# EAGLE design gestion_batterie (EAGLE 9.6.2)
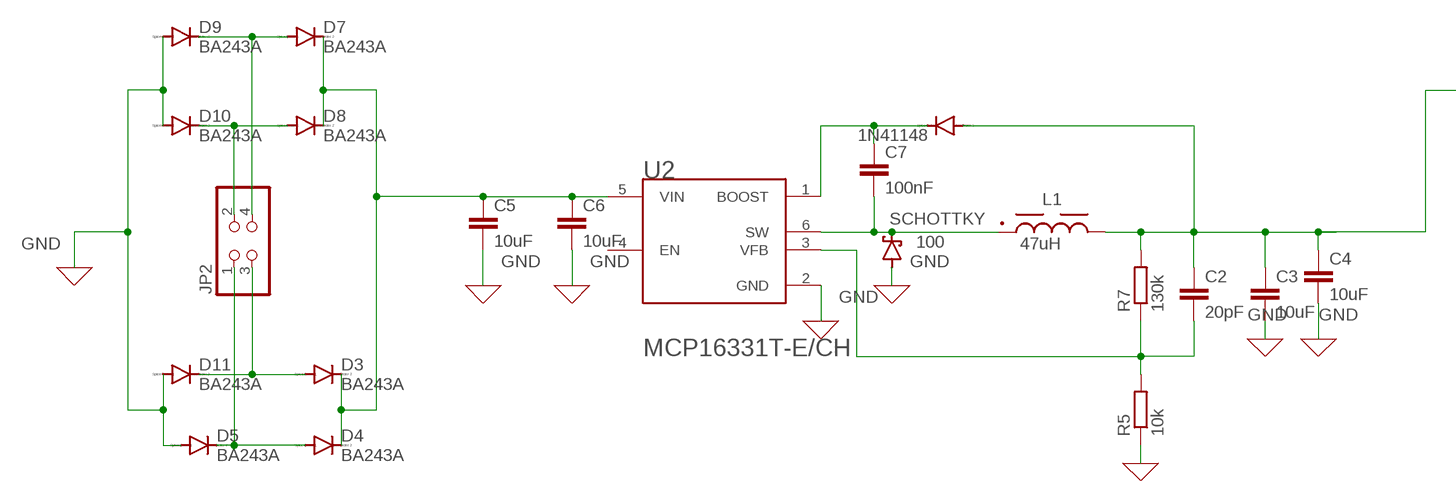
[diagram p0: schematic, sheet 1, part 1 of 2]
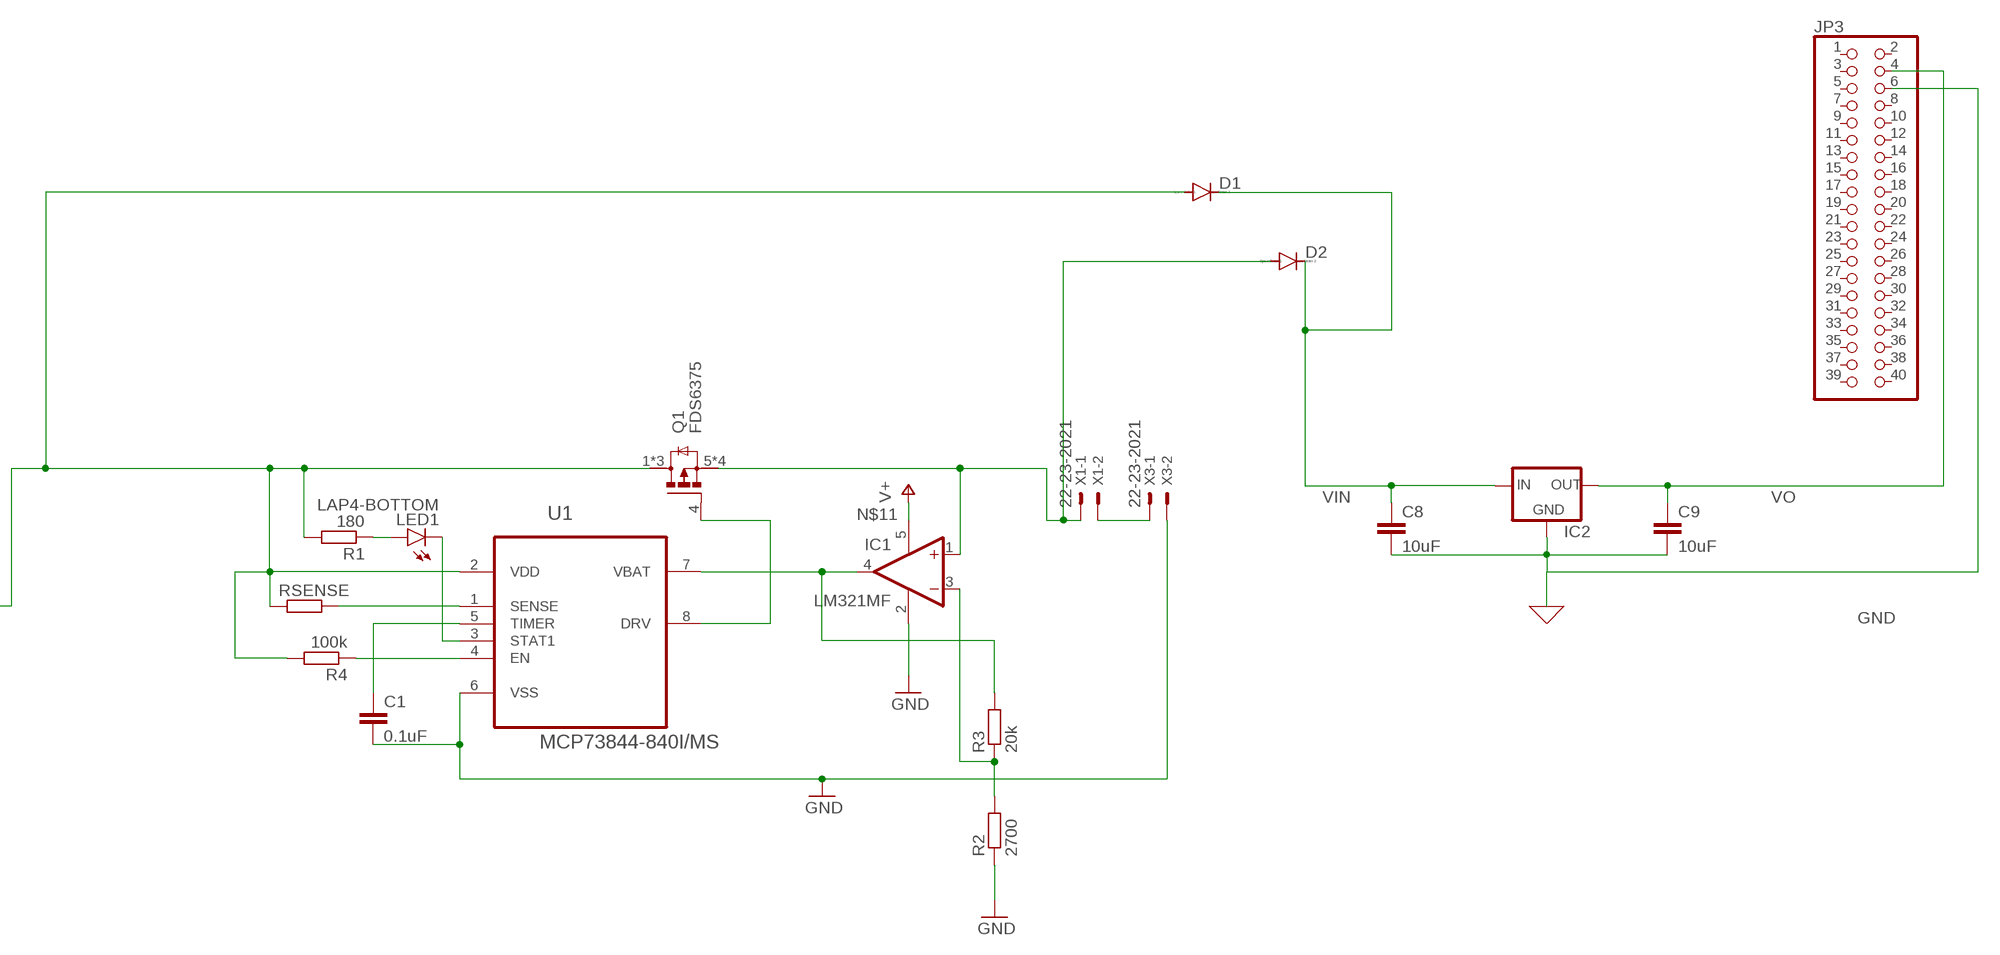
[diagram p1: schematic, sheet 1, part 2 of 2]

## Parts
1N41148  DIODE-SOD323-W  [SOD323-W]
C1  0.1uF  C-EUC1206  [C1206]
C2  20pF  C-EUC1206  [C1206]
C3  10uF  C-EUC1206K  [C1206K]
C4  10uF  C-EUC1206K  [C1206K]
C5  10uF  C-EUC1206K  [C1206K]
C6  10uF  C-EUC1206K  [C1206K]
C7  100nF  C-EUC1206  [C1206]
C8  10uF  C-EUC1206K  [C1206K]
C9  10uF  C-EUC1206K  [C1206K]
D1  DIODE-DO201-15  [DO201-15]
D2  DIODE-DO201-15  [DO201-15]
D3  BA243A  [DO35-10]
D4  BA243A  [DO35-10]
D5  BA243A  [DO35-10]
D7  BA243A  [DO35-10]
D8  BA243A  [DO35-10]
D9  BA243A  [DO35-10]
D10  BA243A  [DO35-10]
D11  BA243A  [DO35-10]
IC1  LM321MF  [SOT23-5]
IC2  78MXXL  [78MXXL]
JP2  PINHD-2X2  [2X02]
JP3  PINHD-2X20  [2X20]
L1  47uH  WE-PDA_1210_7847709470  [WE-PDA_1210]
LED1  LAP4-BOTTOM  [P47F-BOTTOM]
Q1  FDS6375  [SOIC127P600X175-8N]
R1  180  R-EU_R1206  [R1206]
R2  2700  R-EU_R1206  [R1206]
R3  20k  R-EU_R1206  [R1206]
R4  100k  R-EU_R1206  [R1206]
R5  10k  R-EU_R1206  [R1206]
R7  130k  R-EU_R1206  [R1206]
RSENSE  R-EU_R1210  [R1210]
SCHOTTKY  100  SCHOTTKY-DIODECB417-15  [CB417-15]
U1  MCP73844-840I/MS  [SOP65P490X110-8N]
U2  MICROCHIP_MCP16331T-E-CHMICROCHIP_MCP16331T-E-CH_0_0  [MICROCHIP_MCP16331T-E-CH_0]
X1  22-23-2021  [22-23-2021]
X3  22-23-2021  [22-23-2021]

## Nets
GND: C1.2 C3.2 C4.2 C5.2 C6.2 C8.2 C9.2 D5.A D9.A D10.A D11.A IC1.2(V-) IC2.GND JP3.6 R2.1 R5.1 SCHOTTKY.A U1.6(VSS) U2.2(GND) X3.2
N$1: RSENSE.2 U1.1(SENSE)
N$2: C1.1 U1.5(TIMER)
N$3: R4.1 U1.4(EN)
N$4: Q1.4(G) U1.8(DRV)
N$5: IC1.4(OUT) R3.2 U1.7(VBAT)
N$6: X1.2 X3.1
N$7: LED1.A R1.1
N$8: D2.A IC1.1(+IN) Q1.5(D) Q1.6(D) Q1.7(D) Q1.8(D) X1.1
N$9: IC1.3(-IN) R2.2 R3.1
N$10: LED1.C U1.3(STAT1)
N$11: C5.1 C6.1 D3.C D4.C D7.C D8.C IC1.5(V+) U2.5(VIN) ; supply symbol labelled V+
N$12: 1N41148.C C7.1 U2.1(BOOST)
N$13: C7.2 L1.1 SCHOTTKY.C U2.6(SW)
N$14: 1N41148.A C2.1 C3.1 C4.1 D1.A L1.2 Q1.1(S) Q1.2(S) Q1.3(S) R1.2 R4.2 R7.2 RSENSE.1 U1.2(VDD)
N$15: C2.2 R5.2 R7.1 U2.3(VFB)
N$16: D3.A D11.C JP2.3
N$19: D4.A D5.C JP2.1
N$20: D8.A D10.C JP2.2
N$23: D7.A D9.C JP2.4
VIN: C8.1 D1.C D2.C IC2.IN
VO: C9.1 IC2.OUT JP3.4
Unconnected: JP3.1 JP3.2 JP3.3 JP3.5 JP3.7 JP3.8 JP3.9 JP3.10 JP3.11 JP3.12 JP3.13 JP3.14 JP3.15 JP3.16 JP3.17 JP3.18 JP3.19 JP3.20 JP3.21 JP3.22 JP3.23 JP3.24 JP3.25 JP3.26 JP3.27 JP3.28 JP3.29 JP3.30 JP3.31 JP3.32 JP3.33 JP3.34 JP3.35 JP3.36 JP3.37 JP3.38 JP3.39 JP3.40 U2.4(EN)

## Library data of the parts
1N41148 D1 D2 = diode:DIODE-: DIODE
C1-C9 = rcl:C-EU: CAPACITOR, European symbol; SPICEPREFIX: C
D3-D5 D7-D11 = diode:BA243A: DIODE
IC1 = linear:LM321?*: Low Power Single Op Amp Source: http://cache.national.com/ds/LM/LM321.pdf
IC2 = v-reg:78MXXL: VOLTAGE REGULATOR
JP2 = pinhead:PINHD-2X2: PIN HEADER
JP3 = pinhead:PINHD-2X20: PIN HEADER
L1 = Eagle_WE-PDA (rev20b):WE-PDA_1210: WE-PDA SMD Shielded Power Inductor Characteristics Magnetically shielded version which results in a low leakage field High storage capacity High Saturation currents up to 23 A Very low self-losses at high switching frequency's Wide inductance spectrum available at all sizes Operating Temperature -40 °C up to +125 °C Core Material: NiZn Wire connection: welding technology Applications Multimedia applications Switching regulators with low operating voltages Integrated DC/DC-converter Perfect suitable for switching regulators with extremely high efficiency (> 86 %) Plastic base: Because of the one piece construction these are more suitable for high vibration or shock applications <https://www.we-online.com/catalog/media/o55118v209%20Family_WE-PDA.jpg> Details see: https://www.we-online.com/katalog/en/WE-PDA Updated by Ella Wu 2020-03-18 2020(C) Wurth Elektronik; DATASHEET-URL: https://www.we-online.com/catalog/datasheet/7847709470.pdf; FRES: 6.3MHz; IR: 3.2A; ISAT: 3.5A; MOUNT: SMT; PART-NUMBER: 7847709470; RDC-MAX: 67mOhm; RDC-TYP: 56mOhm
LED1 = led:*P4: PointLED® Enhanced Thinfilm LED TOP & BOTTOM mount LS P47F, LR P47F, LA P47F, LY P47F, LT P4SG, LB P4SG, LW P4SG Source: http://catalog.osram-os.com .. LA_LR_LS_LY_P47F_Pb_free.pdf
Q1 = FDS6375:FDS6375: P-Channel 20 V 24 mOhm 2.5V Specified PowerTrench Mosfet SOIC-8 Check prices <https://pricing.snapeda.com/parts/FDS6375/ON%20Semiconductor/view-part?ref=eda>; AVAILABILITY: Good; DESCRIPTION: P-Channel 20V 8A (Ta) 2.5W (Ta) Surface Mount 8-SOIC; MF: ON Semiconductor; MP: FDS6375; PACKAGE: SO-8 ON Semiconductor; PRICE: None; PURCHASE-URL: https://pricing.snapeda.com/search/part/FDS6375/?ref=eda
R1-R5 R7 RSENSE = rcl:R-EU_: RESISTOR, European symbol; SPICEPREFIX: R
SCHOTTKY = diode:SCHOTTKY-DIODE: Schottky Diode
U1 = mcp73844:MCP73844-840I/MS: IC, Dual series cells charge controller,8.4V,MSOP-8; MPN: MCP73844-840I/MS; OC_FARNELL: 1852165; OC_NEWARK: 68H9444; PACKAGE: MSOP-8; SUPPLIER: Microchip
U2 = CH:MICROCHIP_MCP16331T-E-CH: High-Voltage Input Integrated Switch Step-Down Regulator; CENTROID_NOT_SPECIFIED: No; DATASHEET: http://ww1.microchip.com/downloads/en/DeviceDoc/20005308B.pdf; DIGIKEY_DESCRIPTION: IC REG BUCK ADJ 0.5A SOT23-6; DIGIKEY_PART_NUMBER: MCP16331T-E/CHCT-ND; LEAD_FREE: yes; MF: Microchip; MOUSER_PART_NUMBER: 579-MCP16331T-E/CH; MPN: MCP16331T-E/CH; PACKAGE: SOT-23-6; PREFIX: U; ROHS: yes; TEMPERATURE_RANGE_HIGH: +125°C; TEMPERATURE_RANGE_LOW: -40°C
X1 X3 = con-molex:22-23-2021: .100" (2.54mm) Center Header - 2 Pin; MF: MOLEX; MPN: 22-23-2021; OC_FARNELL: 1462926; OC_NEWARK: 25C3832

## Board
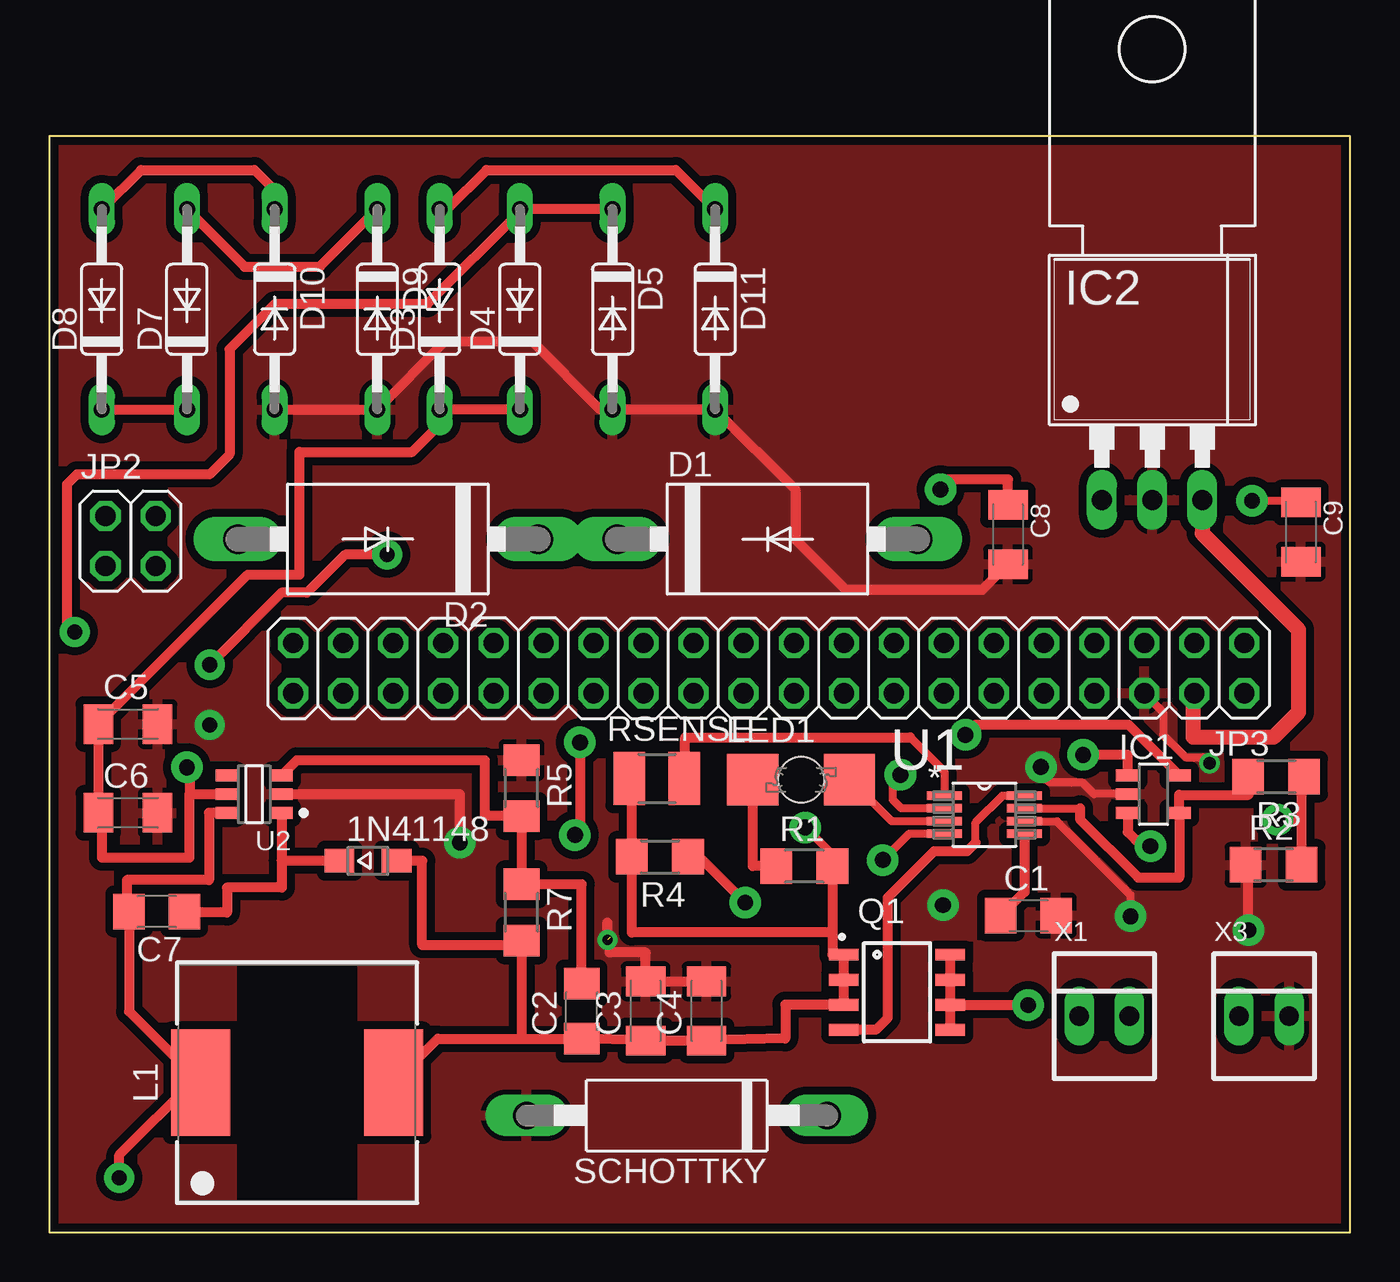
[diagram p2: board, top side]
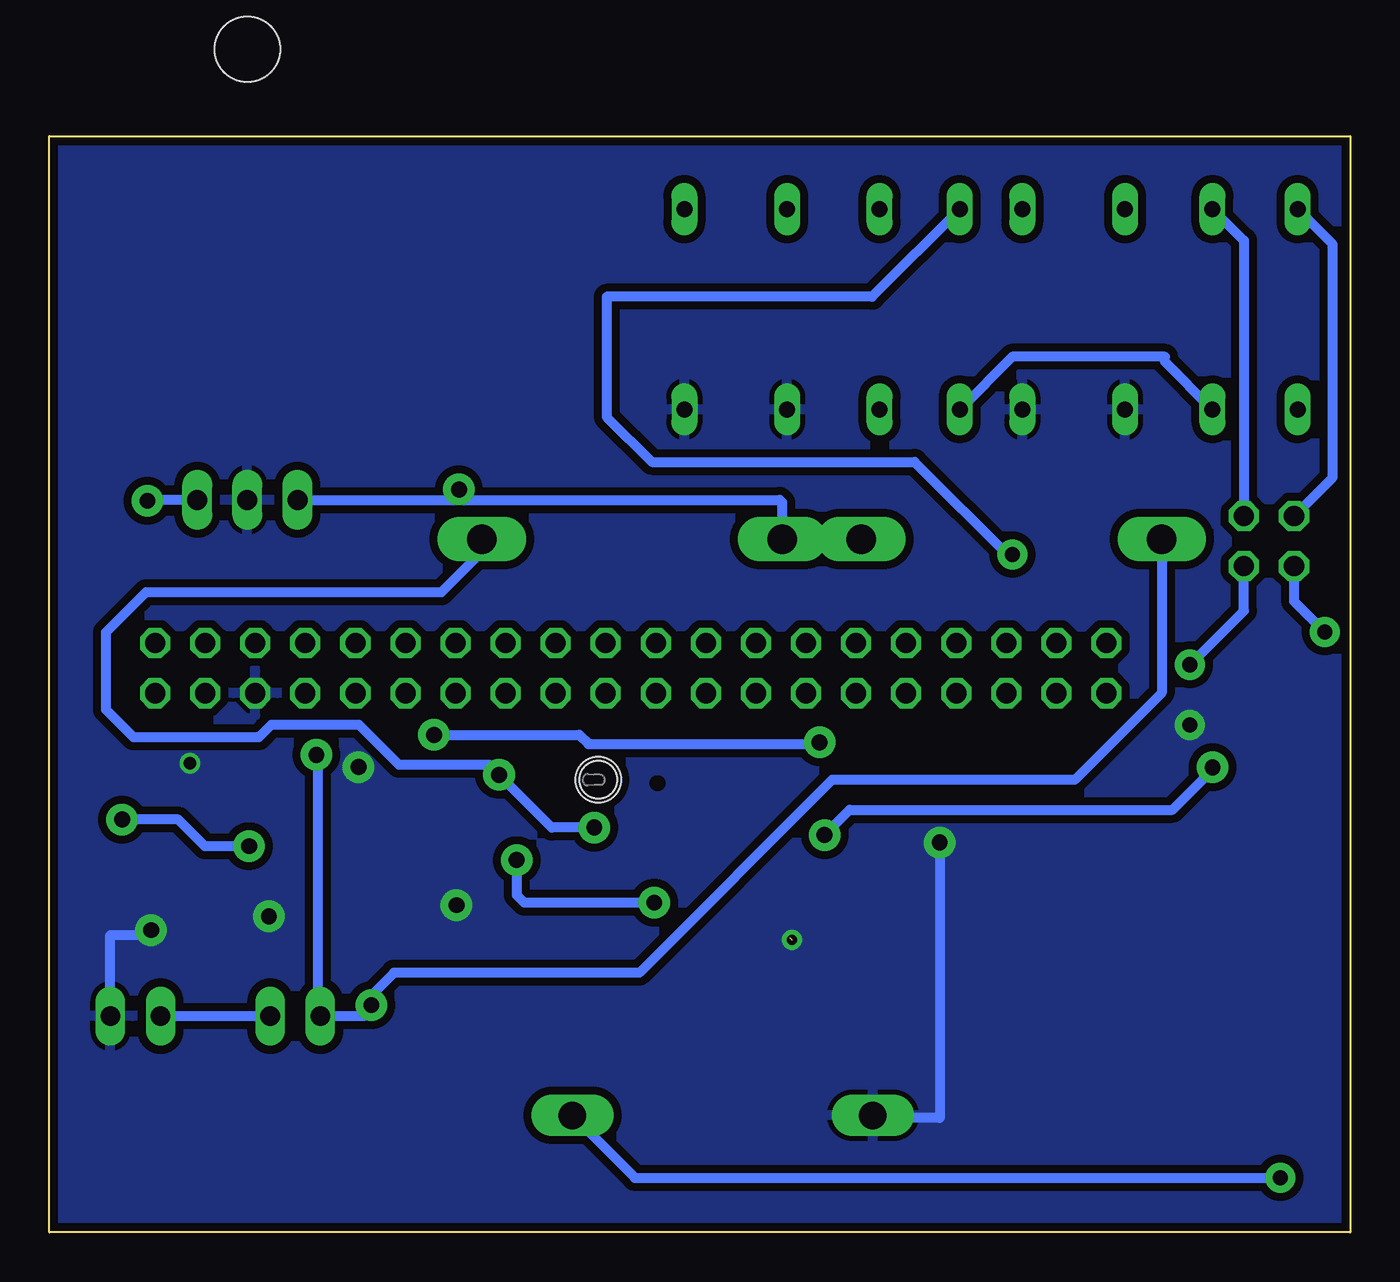
[diagram p3: board, bottom side, seen from below]

Size 66 x 55.62 mm. Coordinates in mm from the lower left corner, seen from the top.
Outline: 0,0 66,0 66,55.62 0,55.62 0,0
Copper layers (1*16): Top 0.035mm / dielectric 1.5mm / Bottom 0.035mm
Design rules "default *": minimum track width 6mil, minimum drill 0.35mm, track to track 16mil, track to pad 16mil, pad to pad 16mil, via to via 16mil, smd to smd 16mil, copper to edge 16mil, drill to drill 6mil, minimum pad ring 10mil, minimum via ring 8mil, stop-mask expansion 4mil, vias tented up to drill 0mil, thermal gap 10mil

### Footprints (pad centres in the part's own frame; a part is rotated, then mirrored left to right if it is on the bottom)
SOD323-W = smd 1.5 x 1.2: A 1.45,0; C -1.45,0
C1206 = smd 1.6 x 1.8: 1 -1.4,0; 2 1.4,0
C1206K = smd 1.5 x 2: 1 -1.5,0; 2 1.5,0
DO201-15 = drill 1.499 long: A 7.62,0; C -7.62,0
DO35-10 = drill 0.813 long: A 5.08,0; C -5.08,0
SOT23-5 = smd 0.6 x 1.2: 1 -0.95,-1.306; 2 0,-1.306; 3 0.95,-1.306; 4 0.95,1.306; 5 -0.95,1.306
78MXXL = drill 1.016 long: GND 0,-5.08; IN -2.54,-5.08; OUT 2.54,-5.08 | hole 3.302: 0,17.78
2X02 = drill 1.016 octagon: 1 -1.27,-1.27; 2 -1.27,1.27; 3 1.27,-1.27; 4 1.27,1.27
2X20 = drill 1.016 octagon: 1 -24.13,-1.27; 2 -24.13,1.27; 3 -21.59,-1.27; 4 -21.59,1.27; 5 -19.05,-1.27; 6 -19.05,1.27; 7 -16.51,-1.27; 8 -16.51,1.27; 9 -13.97,-1.27; 10 -13.97,1.27; 11 -11.43,-1.27; 12 -11.43,1.27; 13 -8.89,-1.27; 14 -8.89,1.27; 15 -6.35,-1.27; 16 -6.35,1.27; 17 -3.81,-1.27; 18 -3.81,1.27; 19 -1.27,-1.27; 20 -1.27,1.27; 21 1.27,-1.27; 22 1.27,1.27; 23 3.81,-1.27; 24 3.81,1.27; 25 6.35,-1.27; 26 6.35,1.27; 27 8.89,-1.27; 28 8.89,1.27; 29 11.43,-1.27; 30 11.43,1.27; 31 13.97,-1.27; 32 13.97,1.27; 33 16.51,-1.27; 34 16.51,1.27; 35 19.05,-1.27; 36 19.05,1.27; 37 21.59,-1.27; 38 21.59,1.27; 39 24.13,-1.27; 40 24.13,1.27
WE-PDA_1210 = smd 5.4 x 3: 1 0,4.9; 2 0,-4.9
P47F-BOTTOM = smd 2.6 x 2.6: A -2.45,0; C 2.45,0 | hole 2.3: 0,0
SOIC127P600X175-8N = smd 1.5 x 0.6: 1 -2.7,1.905; 2 -2.7,0.635; 3 -2.7,-0.635; 4 -2.7,-1.905; 5 2.7,-1.905; 6 2.7,-0.635; 7 2.7,0.635; 8 2.7,1.905
R1206 = smd 1.6 x 1.803: 1 -1.422,0; 2 1.422,0
R1210 = smd 1.6 x 2.7: 1 -1.4,0; 2 1.4,0
CB417-15 = drill 1.397 long: A 7.62,0; C -7.62,0
SOP65P490X110-8N = smd 1.778 x 0.432: 1 -2.032,0.965; 2 -2.032,0.33; 3 -2.032,-0.33; 4 -2.032,-0.965; 5 2.032,-0.965; 6 2.032,-0.33; 7 2.032,0.33; 8 2.032,0.965
MICROCHIP_MCP16331T-E-CH_0 = smd 1.1 x 0.6: 1 -1.4,0.95; 2 -1.4,0; 3 -1.4,-0.95; 4 1.4,-0.95; 5 1.4,0; 6 1.4,0.95
22-23-2021 = drill 1 long: 1 -1.27,0; 2 1.27,0

### Placement (x,y rotation side)
1N41148  16.17,18.85 0 top
C1  49.68,16.07 0 top
C2  27.01,11.22 90 top
C3  30.26,11.23 90 top
C4  33.34,11.23 90 top
C5  3.99,25.78 0 top
C6  3.99,21.28 0 top
C7  5.45,16.28 180 top
C8  48.64,35.4 270 top
C9  63.5,35.53 270 top
D1  36.44,35.17 0 top
D2  17.18,35.17 180 top
D3  19.81,46.83 90 top
D4  23.88,46.83 90 top
D5  28.57,46.83 270 top
D7  6.99,46.83 90 top
D8  2.67,46.83 90 top
D9  16.64,46.83 270 top
D10  11.43,46.83 270 top
D11  33.78,46.83 270 top
IC1  56.02,22.23 270 top
IC2  55.95,42.24 0 top
JP2  4.12,35.07 0 top
JP3  36.5,28.62 180 top
L1  12.57,7.59 90 top
LED1  38.14,22.96 0 top
Q1  43.01,12.18 0 top
R1  38.31,18.58 0 top
R2  62.11,18.64 0 top
R3  62.24,23.12 180 top
R4  30.98,19.05 180 top
R5  23.96,22.54 270 top
R7  23.96,16.23 270 top
RSENSE  30.82,23.03 0 top
SCHOTTKY  31.84,5.93 180 top
U1  47.44,21.18 0 top
U2  10.4,22.23 180 top
X1  53.52,10.97 0 top
X3  61.63,10.97 0 top

### Tracks (layer width: path | path; a pad name or v marks a point on that pad's centre or on a via)
GND  (via drill 0.51 pad 1.02, 0.64 pad 0.64, 0.76 pad 1.52, 0.8 pad 1.6)  (1 unrouted)
  Top 0.406: U1.6 51.12,20.85 54.85,17.12 v54.85,16.03 | IC1.2 53,22.23 52.41,22.81 51.87,22.81 51.85,22.83 50.76,22.83 50.31,23.27 v50.31,23.61 | JP3.6 56.52,26.39 56.52,25.23 57.65,24.1 58.56,24.1 v58.85,23.8
  Top 0.508: U2.2 20.83,22.23 v20.83,19.78 | C3.2 C4.2 | C3.2 30.23,12.63 | v60.83,15.33 60.83,18.64 R2.1 | C3.2 30.26,14.19 28.45,14.19 28.45,14.95 | D10.A D9.A 20.07,45.18 24.51,45.18 27.94,41.75 D5.A D11.A 37.85,37.69 37.85,35.15 40.39,32.61 47.35,32.61 C8.2 | v28.32,14.83 28.32,15.71
  Bottom 0.152: 24.1,5.81 SCHOTTKY.A
  Bottom 0.508: X3.2 62.9,15.08 60.83,15.08 v60.83,15.33 | v20.83,19.78 20.83,5.81 24.1,5.81
  other vias: 45.34,16.6 8.13,25.75
  pour Top: -2.54,64.74 -2.54,-4.22 69.98,-4.22 69.98,64.74
  pour Bottom: -2.41,62.83 -2.41,-4.35 69.98,-4.35 69.98,62.83
N$1
  Top 0.406: 43.69,25.11 45.41,23.39 U1.1
  Top 0.508: RSENSE.2 32.26,23.06 32.26,25.11 43.69,25.11
N$2
  Top 0.508: U1.5 49.47,17.27 C1.1
N$3  (via drill 0.8 pad 1.6)
  Top 0.406: U1.4 43.62,20.21 v42.29,18.89
  Top 0.508: v35.31,16.73 32.98,19.05 R4.1
  Bottom 0.508: v42.29,18.89 42.29,17.11 41.91,16.73 v35.31,16.73
N$4
  Top 0.406: U1.8 48.34,22.14 46.99,20.79 46.99,19.78
  Top 0.508: Q1.4 41.93,10.28 42.55,10.89 42.55,16.98 44.9,19.34 46.57,19.34 46.99,19.76 46.99,19.78
N$5
  Top 0.406: U1.7 52.29,21.51
  Top 0.508: R3.2 60.83,23.12 60.83,22.19 57.33,22.19 IC1.4 57.33,18 55.24,18 52.29,20.95 52.29,21.51
N$6
  Bottom 0.508: X3.1 X1.2
N$7
  Top 0.508: R1.1 35.69,18.58 LED1.A
N$8  (via drill 0.8 pad 1.6)
  Top 0.508: Q1.8 Q1.7 Q1.6 | Q1.5 Q1.6 | v49.66,11.52 45.71,11.52 Q1.6 | v52.45,24.22 54.71,24.22 IC1.1
  Bottom 0.508: 50.04,11.52 v49.66,11.52 | 50.04,11.52 50.04,10.97 X1.1 52.38,11.1 52.38,24.15 v52.45,24.22 | D2.A 9.56,27.36 13.97,22.95 26.29,22.95 36.07,13.17 48.51,13.17 50.04,11.65 50.04,11.52
N$9  (via drill 0.8 pad 1.6)
  Top 0.508: R2.2 63.53,20.92 | 63.53,20.92 63.53,23.12 R3.1 | 63.53,20.92 62.33,20.92 v62.3,20.95 | IC1.3 54.71,20.31 55.12,19.91 55.87,19.91 v55.87,19.59
  Bottom 0.508: v55.87,19.59 58.1,19.59 59.46,20.95 v62.3,20.95
N$10
  Top 0.406: U1.3 42.74,20.85 40.63,22.96 LED1.C
N$11  (via drill 0.8 pad 1.6)
  Top 0.508: 7.11,22.23 U2.5 | 7.11,22.23 7.11,19.02 2.67,19.02 2.67,21.28 C6.1 C5.1 10.08,33.37 12.7,33.37 12.7,39.59 18.41,39.59 19.81,40.99 D3.C D4.C | v26.92,24.86 26.92,20.16 v26.67,20.16 | v6.99,23.59 7.11,23.46 7.11,22.23 | IC1.5 54.76,25.75 46.99,25.75 v46.48,25.24 | D8.C D7.C
  Bottom 0.508: v26.92,24.86 27.05,24.86 27.14,24.77 38.65,24.77 39.12,25.24 v46.48,25.24 | v26.67,20.16 25.4,21.43 9.02,21.43 6.99,23.46 v6.99,23.59 | D7.C 9.4,44.16 9.4,44.42 17.14,44.42 D3.C
N$12
  Top 0.508: U2.1 11.8,18.89 11.8,18.85 | 11.8,18.85 11.8,17.49 9.02,17.49 9.02,16.22 6.85,16.22 C7.1 | 1N41148.C 11.8,18.85
N$13  (via drill 0.76 pad 1.52)
  Top 0.152: 7.52,7.74 7.37,7.74
  Top 0.508: U2.6 8.11,21.28 8.11,17.87 3.94,17.87 3.94,16.28 C7.2 4.05,11.21 7.52,7.74 L1.1 | v3.56,2.76 3.56,3.93 7.37,7.74
  Bottom 0.508: SCHOTTKY.C 36.29,2.76 v3.56,2.76
N$14  (via drill 0.8 pad 1.6)
  Top 0.406: U1.2 43.23,21.51 42.8,21.94 42.8,22.83 v43.18,23.21 | v38.35,20.54 39.73,19.16 R1.2
  Top 0.508: 1N41148.A 18.92,18.85 18.92,14.57 23.96,14.57 R7.2 23.96,9.82 | 23.96,9.82 26.8,9.82 | 26.8,9.82 C2.1 | 26.8,9.82 26.8,9.83 C3.1 C4.1 37.34,9.83 37.34,11.55 Q1.3 Q1.2 Q1.1 39.73,14.09 39.73,15.21 | R1.2 39.73,15.21 | 39.73,15.21 29.56,15.21 R4.2 29.56,23.03 RSENSE.1 | L1.2 19.71,9.82 23.96,9.82
  Bottom 0.508: D1.A 44.06,34.52 46.1,32.48 61.09,32.48 63.12,30.45 63.12,26.51 61.72,25.11 55.37,25.11 54.74,25.75 50.29,25.75 48.26,23.71 43.69,23.71 v43.18,23.21 40.51,20.54 v38.35,20.54
N$15
  Top 0.508: U2.3 12.56,23.94 22.1,23.94 22.1,21.12 R5.2 R7.1 27.01,17.65 C2.2
N$16  (via drill 0.76 pad 1.52)
  Top 0.508: D3.A 20.19,51.91 22.18,53.9 31.8,53.9 D11.C | v8.13,28.8 11.79,32.45 13.08,32.45 15.01,34.38 v17.14,34.38
  Bottom 0.508: D3.A 24.26,47.46 37.72,47.46 37.72,41.37 35.43,39.08 22.1,39.08 17.27,34.26 v17.14,34.38 | v8.13,28.8 5.39,31.53 JP2.3
N$19  (via drill 0.76 pad 1.52)
  Top 0.508: D5.C D4.A 23.88,51.78 19.18,47.08 11.43,47.08 9.14,44.8 9.14,39.46 8.13,38.45 1.4,38.45 0.89,37.94 0.89,30.45 v1.29,30.45
  Bottom 0.508: v1.29,30.45 2.85,32.01 JP2.1
N$20
  Top 0.508: D10.C 11.43,52.88 10.41,53.9 4.65,53.9 D8.A
  Bottom 0.508: JP2.2 0.89,38.3 0.89,50.13 D8.A
N$23
  Top 0.508: D7.A 9.91,48.99 13.72,48.99 D9.C
  Bottom 0.508: D7.A 5.39,50.31 JP2.4
VIN  (via drill 0.8 pad 1.6)
  Top 0.508: v45.21,37.69 45.21,38.19 48.64,38.19 C8.1
  Bottom 0.508: D2.C D1.C 28.82,37.04 28.94,37.16 45.21,37.16 | IC2.IN 45.21,37.16 | v45.21,37.69 45.21,37.16
VO  (via drill 0.8 pad 1.6)
  Top 0.406: v61.02,37.11 63.41,37.11 C9.1
  Top 0.762: IC2.OUT 58.49,35.46 63.37,30.57 63.37,26.38 62.1,25.11 58.04,25.11 58.04,27.3 JP3.4
  Bottom 0.508: IC2.OUT 60.94,37.16 60.96,37.18 v61.02,37.11